# Altium schematic sheet LED.SchDoc
size A4; Engineer: JBayalas; DocumentNumber: 10; Revision: V1.1; SheetNumber: 10; SheetTotal: 13
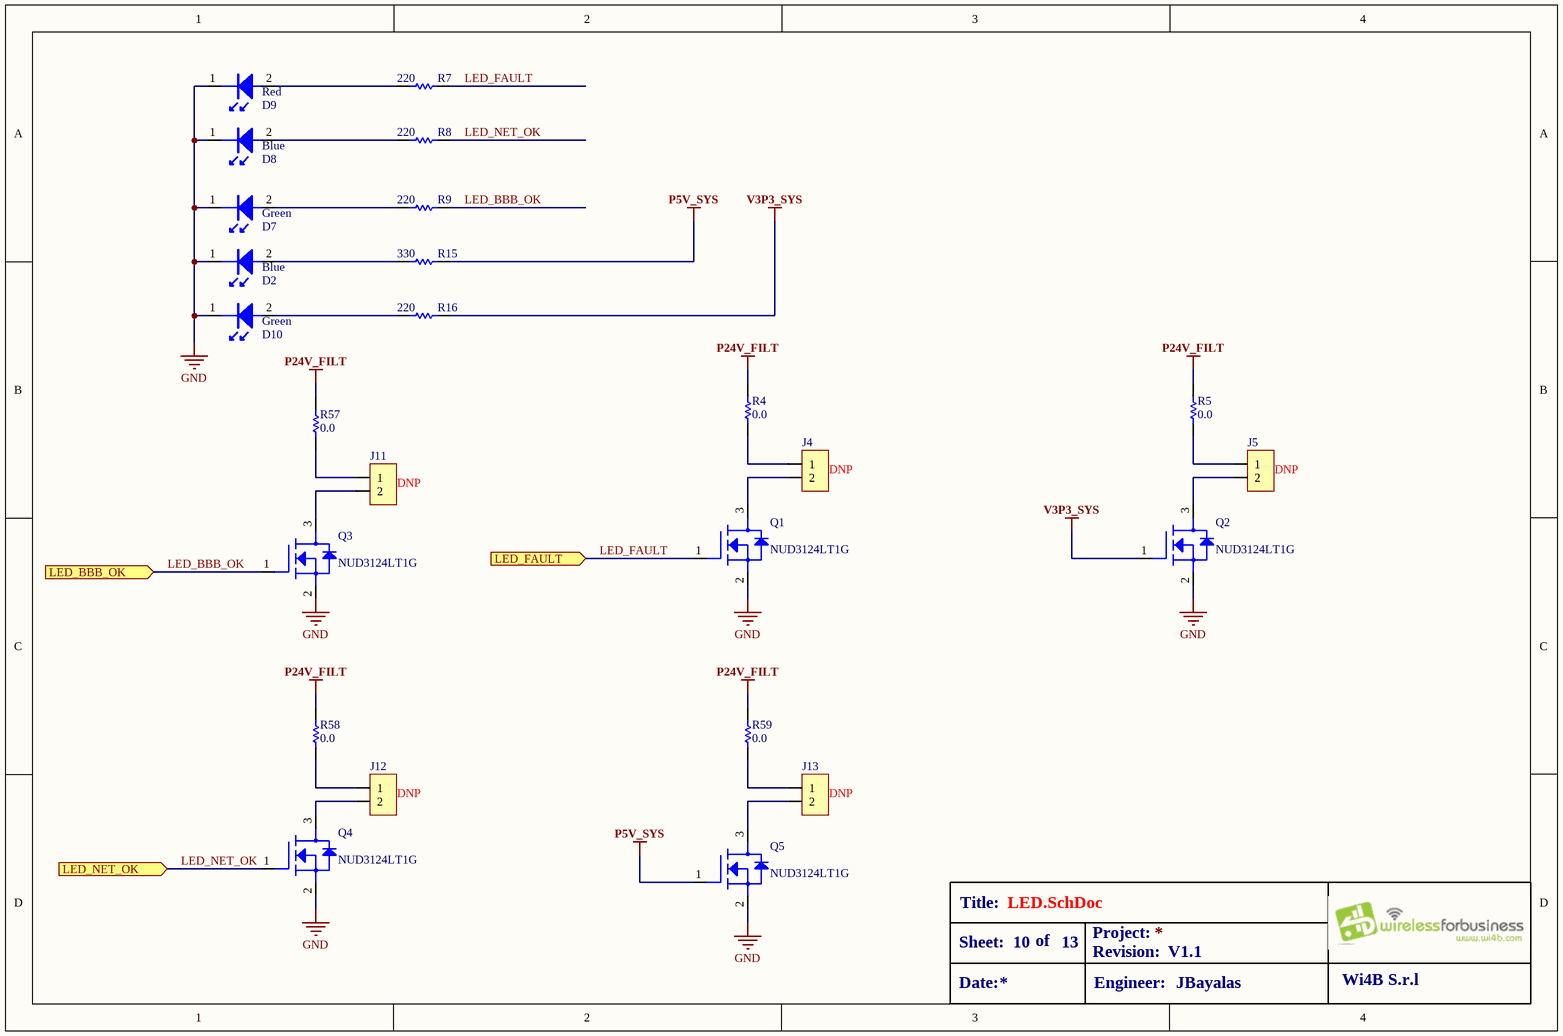
[diagram p0: LED.SchDoc]

## Parts
D2  value Blue  [LED0402(BLUE)]  (hidden comment: *)
D7  value Green  [LED0402(GREEN)]  (hidden comment: *)
D8  value Blue  [LED0402(BLUE)]  (hidden comment: *)
D9  value Red  [LED0402(RED)]  (hidden comment: *)
D10  value Green  [LED0402(GREEN)]  (hidden comment: *)
J4  LOAD: DNP  [2pin 5mm Pitch]  (hidden comment: *)
J5  LOAD: DNP  [2pin 5mm Pitch]  (hidden comment: *)
J11  LOAD: DNP  [2pin 5mm Pitch]  (hidden comment: *)
J12  LOAD: DNP  [2pin 5mm Pitch]  (hidden comment: *)
J13  LOAD: DNP  [2pin 5mm Pitch]  (hidden comment: *)
Q1  *  [SOT-23-3]  (value not drawn)
Q2  *  [SOT-23-3]  (value not drawn)
Q3  *  [SOT-23-3]  (value not drawn)
Q4  *  [SOT-23-3]  (value not drawn)
Q5  *  [SOT-23-3]  (value not drawn)
R4  value 0.0  [R1206]  (hidden comment: *)
R5  value 0.0  [R1206]  (hidden comment: *)
R7  value 220  [R0402]  (hidden comment: *)
R8  value 220  [R0402]  (hidden comment: *)
R9  value 220  [R0402]  (hidden comment: *)
R15  value 330  [R0402]  (hidden comment: *)
R16  value 220  [R0402]  (hidden comment: *)
R57  value 0.0  [R1206]  (hidden comment: *)
R58  value 0.0  [R1206]  (hidden comment: *)
R59  value 0.0  [R1206]  (hidden comment: *)

## Ports
LED_BBB_OK (in), LED_FAULT (in), LED_NET_OK (in)

## Nets
GND: D2.1 D7.1 D8.1 D9.1 D10.1 Q1.2(source) Q2.2(source) Q3.2(source) Q4.2(source) Q5.2(source)
P5V_SYS: Q5.1(gate) R15.2
P24V_FILT: R4.2 R5.2 R57.2 R58.2 R59.2
V3P3_SYS: Q2.1(gate) R16.2
LED_BBB_OK: Q3.1(gate) R9.2 ; port LED_BBB_OK
LED_FAULT: Q1.1(gate) R7.2 ; port LED_FAULT
LED_NET_OK: Q4.1(gate) R8.2 ; port LED_NET_OK
NetD2_2: D2.2 R15.1
NetD7_2: D7.2 R9.1
NetD8_2: D8.2 R8.1
NetD9_2: D9.2 R7.1
NetD10_2: D10.2 R16.1
NetJ4_1: J4.1 R4.1
NetJ4_2: J4.2 Q1.3(drain)
NetJ5_1: J5.1 R5.1
NetJ5_2: J5.2 Q2.3(drain)
NetJ11_1: J11.1 R57.1
NetJ11_2: J11.2 Q3.3(drain)
NetJ12_1: J12.1 R58.1
NetJ12_2: J12.2 Q4.3(drain)
NetJ13_1: J13.1 R59.1
NetJ13_2: J13.2 Q5.3(drain)

## Notes on the sheet
- Title:
- Sheet:
- Date:
- of
- Project:
- Revision:
- Engineer:
- Wi4B S.r.l

## Library data of the parts
D2 D8 = VLMB1500-GS08: LED BLUE 0402 SMD; MFT: Vishay Semiconductor Opto Division; MPN: VLMB1500-GS08; TYPE: SMD; RATING: *; LOAD: *; FUNCTION: LED
D7 D10 = LNJ347W83RA: LED GREEN 0402 SMD; MFT: Panasonic Electronic Components; TYPE: Surface Mount; MPN: LNJ347W83RA; FUNCTION: LED
D9 = LNJ247W82RA: LED RED 0402 SMD; MFT: Panasonic Electronic Components; TYPE: Surface Mount; MPN: LNJ247W82RA; FUNCTION: LED
J4 J5 J11-J13 = 2PIN Signal 5mm Pitch: FUNCTION: LED
Q1-Q5 = NUD3124LT1G: IC INDCT LOAD DRVR AUTO SOT23; MFT: ON Semiconductor; TYPE: Surface Mount; FUNCTION: LED; VALUE: NUD3124LT1G; MPN: NUD3124LT1G
R4 R5 R57-R59 = RC1206JR-070RL: RES SMD 0.0 OHM JUMPER 1/4W 1206; MFT: Yageo; FUNCTION: LED; MPN: RC1206JR-070RL; TYPE: Surface Mount
R7-R9 R16 = RC0402JR-07220RL: RES SMD 220 OHM 5% 1/16W 0402; MFT: Yageo; FUNCTION: LED; MPN: RC0402JR-07220RL; RATING: *; TYPE: SMD; LOAD: *
R15 = CRCW0402330RFKED: RES SMD 330 OHM 1% 1/16W 0402; MFT: Vishay Dale; FUNCTION: LED; MPN: CRCW0402330RFKED; TYPE: SMD; RATING: 1/16W; LOAD: *